# EAGLE design TelematicsBoard (EAGLE 7.6.0)
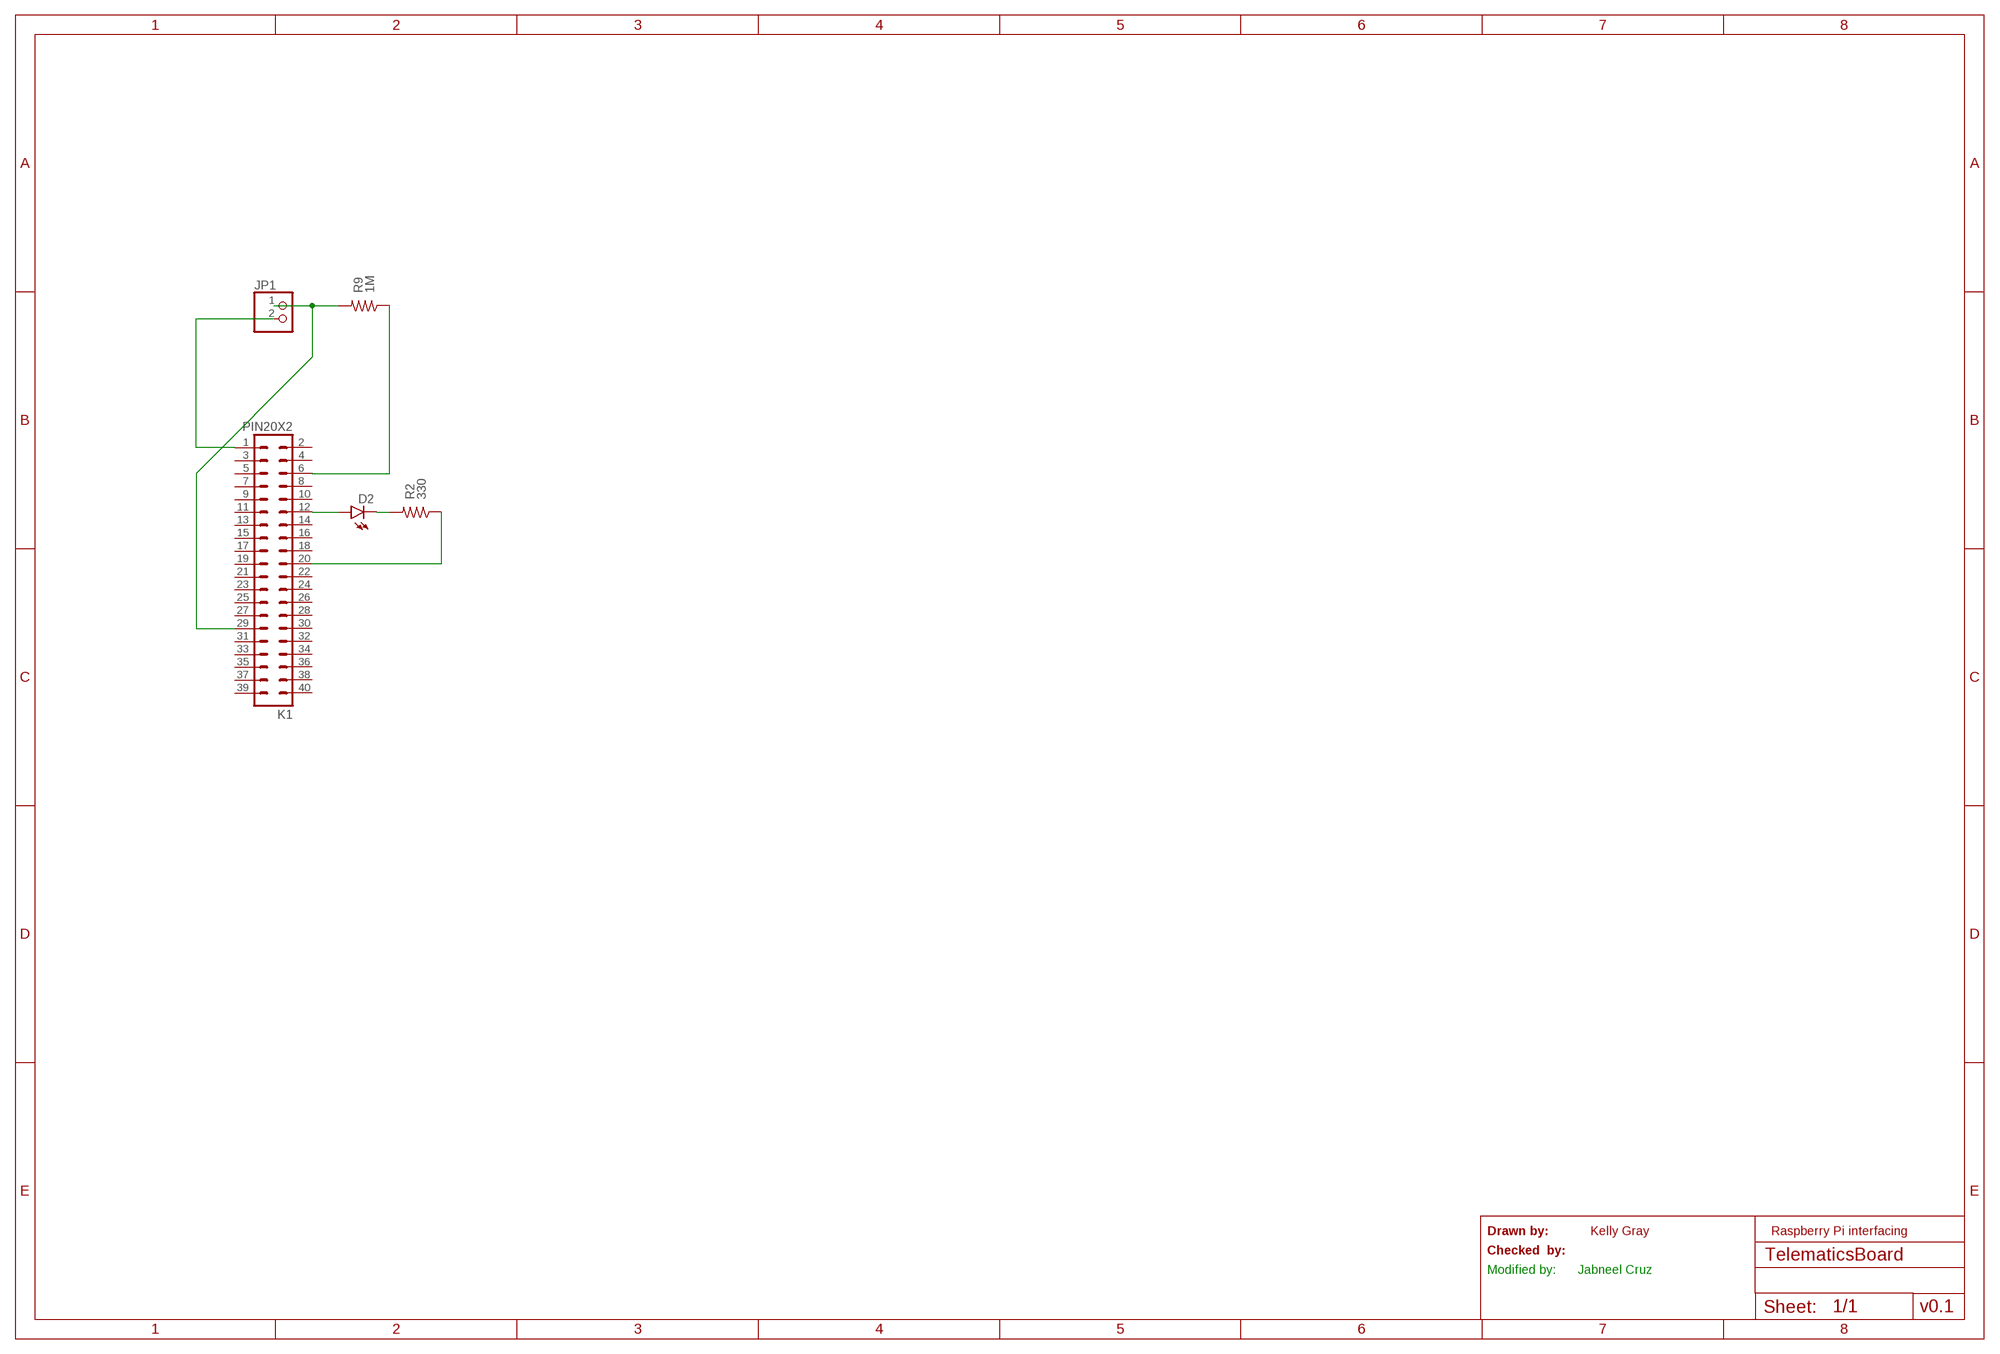
[diagram p0: schematic, sheet 1]

## Parts
D2  LED-3MM-NO_SILK  [LED3MM-NS]
JP1  PINHD-1X2  [1X02]
K1  PIN20X2  [PIN_20X2]
R2  330  1KOHM-1/4W-1%(PTH)  [AXIAL-0.3]
R9  1M  1KOHM-1/4W-1%(PTH)  [AXIAL-0.3]

## Nets
N$1: D2.A K1.12
N$2: JP1.2 K1.1
N$3: D2.K(C) R2.P$2
N$6: K1.20 R2.P$1
N$8: K1.6 R9.P$1
N$9: JP1.1 K1.29 R9.P$2
Unconnected: K1.2 K1.3 K1.4 K1.5 K1.7 K1.8 K1.9 K1.10 K1.11 K1.13 K1.14 K1.15 K1.16 K1.17 K1.18 K1.19 K1.21 K1.22 K1.23 K1.24 K1.25 K1.26 K1.27 K1.28 K1.30 K1.31 K1.32 K1.33 K1.34 K1.35 K1.36 K1.37 K1.38 K1.39 K1.40

## Notes on the sheet
- Drawn by: | Kelly Gray | Raspberry Pi interfacing
- Checked  by:
- Modified by: | Jabneel Cruz
- v0.1

## Library data of the parts
D2 = SparkFun-LED:LED: LEDs Standard schematic elements and footprints for 5mm, 3mm, 1206, and 0603 sized LEDs. 5mm - Spark Fun Electronics SKU : COM-00529 (and others)
JP1 = pinhead:PINHD-1X2: PIN HEADER
K1 = FLYFISH:PIN20X2
R2 R9 = SparkFun-Resistors:1KOHM-1/4W-1%(PTH): RES-12182; PROD_ID: RES-12182; TOLERANCE: 5%; VALUE: 1K

## Board
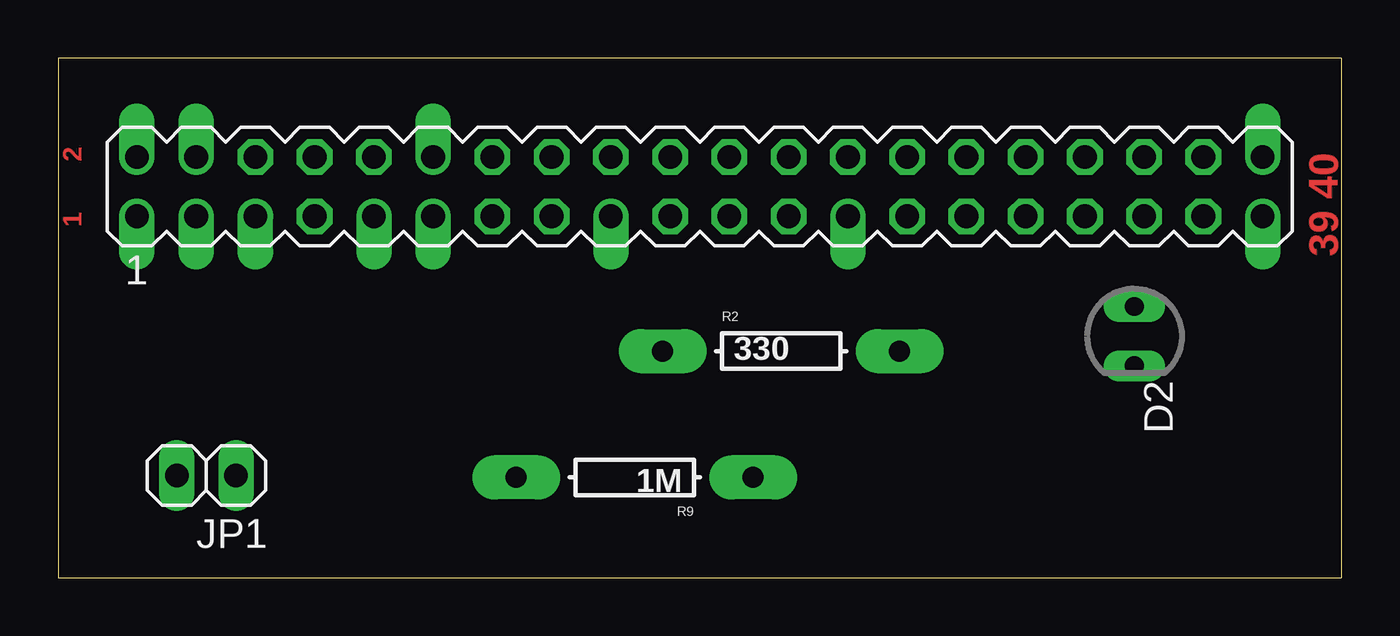
[diagram p1: board, top side]
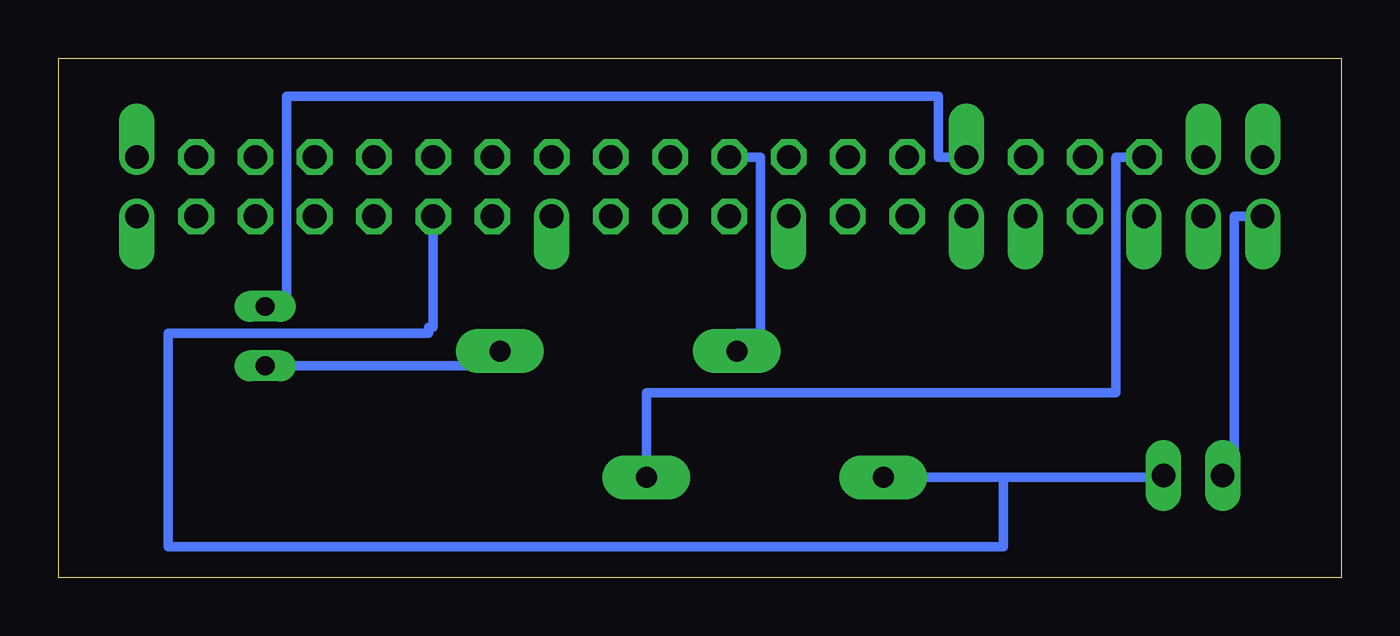
[diagram p2: board, bottom side, seen from below]

Size 55 x 22.25 mm. Coordinates in mm from the lower left corner, seen from the top.
Outline: 0,0 55,0 55,22.25 0,22.25 0,0
Copper layers (1*16): Top 0.035mm / dielectric 1.5mm / Bottom 0.035mm
Design rules "ITEADstudio_DRC *": minimum track width 6mil, minimum drill 0.8mm, track to track 12mil, track to pad 12mil, pad to pad 12mil, via to via 12mil, smd to smd 0mil, copper to edge 10mil, drill to drill 10mil, minimum pad ring 10mil, minimum via ring 12mil, stop-mask expansion 2mil, vias tented up to drill 100mil, thermal gap 10mil

### Footprints (pad centres in the part's own frame; a part is rotated, then mirrored left to right if it is on the bottom)
LED3MM-NS = drill 0.813 long: A -1.27,0; K 1.27,0
1X02 = drill 1.016 long: 1 -1.27,0; 2 1.27,0
PIN_20X2 = drill 1.016 offset: 1 -24.13,-1.27; 2 -24.13,1.27; 3 -21.59,-1.27; 4 -21.59,1.27; 5 -19.05,-1.27; 9 -13.97,-1.27; 11 -11.43,-1.27; 12 -11.43,1.27; 17 -3.81,-1.27; 25 6.35,-1.27; 39 24.13,-1.27; 40 24.13,1.27 | drill 1.016 octagon: 6 -19.05,1.27; 7 -16.51,-1.27; 8 -16.51,1.27; 10 -13.97,1.27; 13 -8.89,-1.27; 14 -8.89,1.27; 15 -6.35,-1.27; 16 -6.35,1.27; 18 -3.81,1.27; 19 -1.27,-1.27; 20 -1.27,1.27; 21 1.27,-1.27; 22 1.27,1.27; 23 3.81,-1.27; 24 3.81,1.27; 26 6.35,1.27; 27 8.89,-1.27; 28 8.89,1.27; 29 11.43,-1.27; 30 11.43,1.27; 31 13.97,-1.27; 32 13.97,1.27; 33 16.51,-1.27; 34 16.51,1.27; 35 19.05,-1.27; 36 19.05,1.27; 37 21.59,-1.27; 38 21.59,1.27
AXIAL-0.3 = drill 0.9 pad 1.88 long: P$1 -5.08,0; P$2 5.08,0

### Placement (x,y rotation side)
D2  46.13,10.35 270 top
JP1  6.35,4.37 180 top
K1  27.5,16.75 0 top
R2  30.99,9.7 0 top
R9  24.71,4.29 180 top

### Tracks (layer width: path | path; a pad name or v marks a point on that pad's centre or on a via)
N$1
  Bottom 0.406: K1.12 17.27,18.02 17.27,20.63 45.21,20.63 45.21,11.48 46.13,11.48 D2.A
N$2
  Bottom 0.406: K1.1 4.57,15.48 4.57,4.37 JP1.2
N$3
  Bottom 0.406: D2.K 36.07,9.08 R2.P$2
N$4
  cutout Top (isolate 0.813): 49.78,22.15 54.36,22.15 54.36,11.74 49.78,11.74
  cutout Bottom (isolate 0.813): 49.78,22.15 54.36,22.15 54.36,11.74 49.78,11.74
N$5
  cutout Top (isolate 0.813): 0,22.15 35.31,22.15 35.31,11.48 0,11.48
  cutout Bottom (isolate 0.813): 0,22.15 35.31,22.15 35.31,11.48 0,11.48
N$6
  Bottom 0.406: K1.20 24.89,18.02 24.89,10.47 25.91,10.47 R2.P$1
N$8
  Bottom 0.406: K1.6 9.65,18.02 9.65,7.93 29.79,7.93 R9.P$1
N$9
  Bottom 0.406: JP1.1 7.62,4.29 R9.P$2 14.48,4.29 14.48,1.32 50.29,1.32 50.29,10.47 39.12,10.47 39.12,10.72 38.93,10.72 K1.29 38.86,15.48

### Text on the board
Top: 2 | 1 | 39 40